# Altium schematic sheet 8_Front_Pannel_Con.SchDoc: Front Pannel Con
size A4; ApprovedBy: Alcatraz; CheckedBy: Alcatraz; Author: Alcatraz; CompanyName: DHNLAB; DrawnBy: Alcatraz; Engineer: Alcatraz; Organization: DHNLAB PVT LTD; Address1: DHANBAD; Address2: JHARKHAND; Address3: INDIA; Address4: ASIA; DocumentNumber: 8; Revision: 1.0; SheetNumber: 8; SheetTotal: 10; ProjectTitle: ESP8266-Deskop_Power
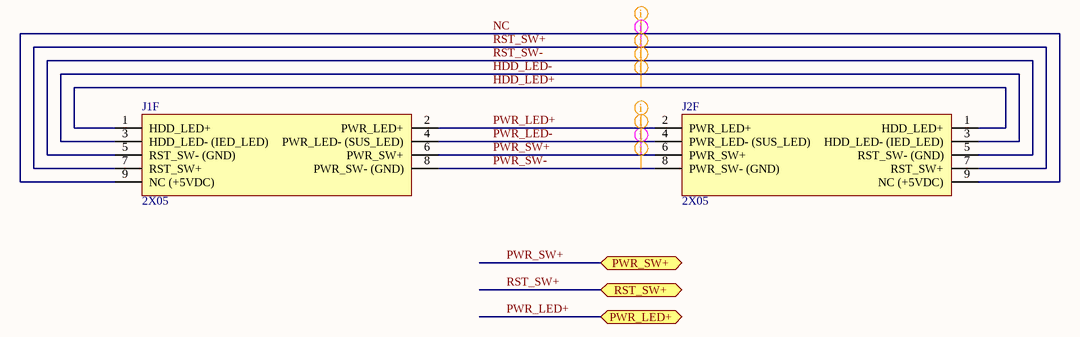
[diagram p0: 8_Front_Pannel_Con.SchDoc]

## Parts
J1F  2X05  [Front_Pannel_2x05_P2.54mm_Horizontal_Right]
J2F  2X05  [Front_Pannel_2x05_P2.54mm_Horizontal_Left]

## Ports
PWR_LED+ (bidir, see 3_ESP8266_Core[4B]), PWR_SW+ (bidir, see 3_ESP8266_Core[4B]), RST_SW+ (bidir, see 3_ESP8266_Core[4B])

## Nets
HDD_LED+: J1F.1(HDD_LED+) J2F.1(HDD_LED+)
HDD_LED-: J1F.3(HDD_LED-_(IED_LED)) J2F.3(HDD_LED-_(IED_LED))
NC: J1F.9(NC_(+5VDC)) J2F.9(NC_(+5VDC))
PWR_LED+: J1F.2(PWR_LED+) J2F.2(PWR_LED+) ; port PWR_LED+
PWR_LED-: J1F.4(PWR_LED-_(SUS_LED)) J2F.4(PWR_LED-_(SUS_LED))
PWR_SW+: J1F.6(PWR_SW+) J2F.6(PWR_SW+) ; port PWR_SW+
PWR_SW-: J1F.8(PWR_SW-_(GND)) J2F.8(PWR_SW-_(GND))
RST_SW+: J1F.7(RST_SW+) J2F.7(RST_SW+) ; port RST_SW+
RST_SW-: J1F.5(RST_SW-_(GND)) J2F.5(RST_SW-_(GND))

## Layout directives
net class Power; net class PowerRails_LowVoltage_DC; net class Power_Signal: HDD_LED+, HDD_LED-, NC, PWR_LED+, PWR_LED-, PWR_SW-, RST_SW-
net class Digital_Signal_Low_Speed; net class Signal_75_ohm: PWR_SW+, RST_SW+

## Notes on the sheet
- Title:
- Author:
- Approved:
- Size:
- Date:
- Git Hash:
- A4
- Prj:
- SW Version:
- Variant:
- Edited:
- PUBLIC
- File:

## Library data of the parts
J1F J2F = Front_Pannel_2x05_P2.54mm